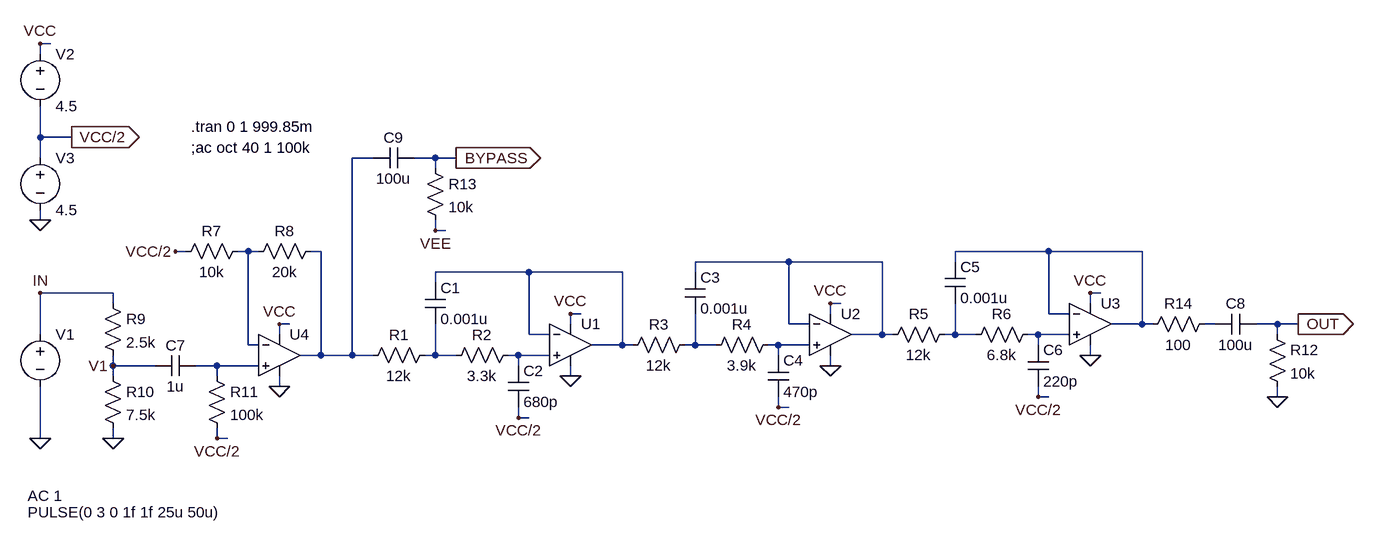
[diagram p0: schematic Nucleo_DCO_Output_VCVS_6th_Bessel_SQR_2.asc]
Nucleo_DCO_Output_VCVS_6th_Bessel_SQR_2.asc, the LTspice schematic file:
Version 4
SHEET 1 2020 680
WIRE -192 -448 -208 -448
WIRE -208 -432 -208 -448
WIRE -208 -304 -208 -352
WIRE -160 -304 -208 -304
WIRE -208 -272 -208 -304
WIRE 304 -272 272 -272
WIRE 400 -272 368 -272
WIRE 432 -272 400 -272
WIRE 400 -256 400 -272
WIRE -208 -176 -208 -192
WIRE 400 -160 400 -176
WIRE 416 -160 400 -160
WIRE 16 -128 0 -128
WIRE 112 -128 96 -128
WIRE 128 -128 112 -128
WIRE 224 -128 208 -128
WIRE 1344 -128 1200 -128
WIRE 1488 -128 1344 -128
WIRE 944 -112 800 -112
WIRE 1088 -112 944 -112
WIRE 1200 -112 1200 -128
WIRE 544 -96 400 -96
WIRE 688 -96 544 -96
WIRE 800 -96 800 -112
WIRE 400 -80 400 -96
WIRE -96 -64 -208 -64
WIRE 1424 -64 1408 -64
WIRE -96 -48 -96 -64
WIRE 1024 -48 1008 -48
WIRE 1408 -48 1408 -64
WIRE 624 -32 608 -32
WIRE 1008 -32 1008 -48
WIRE 1344 -32 1344 -128
WIRE 1376 -32 1344 -32
WIRE 176 -16 160 -16
WIRE 608 -16 608 -32
WIRE 944 -16 944 -112
WIRE 976 -16 944 -16
WIRE 1488 -16 1488 -128
WIRE 1488 -16 1440 -16
WIRE 1504 -16 1488 -16
WIRE 1600 -16 1584 -16
WIRE 1696 -16 1664 -16
WIRE 1728 -16 1696 -16
WIRE -208 0 -208 -64
WIRE 160 0 160 -16
WIRE 544 0 544 -96
WIRE 576 0 544 0
WIRE 1088 0 1088 -112
WIRE 1088 0 1040 0
WIRE 1104 0 1088 0
WIRE 1200 0 1200 -48
WIRE 1200 0 1184 0
WIRE 1232 0 1200 0
WIRE 1328 0 1312 0
WIRE 1376 0 1328 0
WIRE 1696 0 1696 -16
WIRE 112 16 112 -128
WIRE 128 16 112 16
WIRE 688 16 688 -96
WIRE 688 16 640 16
WIRE 704 16 688 16
WIRE 800 16 800 -32
WIRE 800 16 784 16
WIRE 832 16 800 16
WIRE 928 16 912 16
WIRE 976 16 928 16
WIRE 1328 16 1328 0
WIRE 224 32 224 -128
WIRE 224 32 192 32
WIRE 272 32 272 -272
WIRE 272 32 224 32
WIRE 304 32 272 32
WIRE 400 32 400 -16
WIRE 400 32 384 32
WIRE 432 32 400 32
WIRE 528 32 512 32
WIRE 576 32 528 32
WIRE 928 32 928 16
WIRE 1408 32 1408 16
WIRE -96 48 -96 32
WIRE -32 48 -96 48
WIRE 64 48 32 48
WIRE 128 48 64 48
WIRE 528 48 528 32
WIRE 1008 48 1008 32
WIRE -96 64 -96 48
WIRE 64 64 64 48
WIRE 608 64 608 48
WIRE 160 80 160 64
WIRE 1328 96 1328 80
WIRE 1344 96 1328 96
WIRE 1696 96 1696 80
WIRE 928 112 928 96
WIRE 944 112 928 112
WIRE 528 128 528 112
WIRE 544 128 528 128
WIRE -208 160 -208 80
WIRE -96 160 -96 144
WIRE 64 160 64 144
WIRE 80 160 64 160
FLAG 608 -32 VCC
FLAG -208 -448 VCC
FLAG -208 -64 IN
FLAG 1728 -16 OUT
IOPIN 1728 -16 Out
FLAG 1008 -48 VCC
FLAG 1408 -64 VCC
FLAG 160 -16 VCC
FLAG -208 -176 0
FLAG 432 -272 BYPASS
IOPIN 432 -272 Out
FLAG 400 -160 VEE
FLAG -160 -304 VCC/2
IOPIN -160 -304 Out
FLAG -208 160 0
FLAG -96 160 0
FLAG 0 -128 VCC/2
FLAG 64 160 VCC/2
FLAG 528 128 VCC/2
FLAG 928 112 VCC/2
FLAG 1328 96 VCC/2
FLAG 160 80 0
FLAG 608 64 0
FLAG 1008 48 0
FLAG 1408 32 0
FLAG 1696 96 0
FLAG -96 48 V1
SYMBOL voltage -208 -16 R0
WINDOW 3 -19 290 Left 2
WINDOW 123 -19 264 Left 2
WINDOW 39 0 0 Left 2
SYMATTR Value PULSE(0 3 0 1f 1f 25u 50u)
SYMATTR Value2 AC 1
SYMATTR InstName V1
SYMBOL res 400 16 R90
WINDOW 0 0 56 VBottom 2
WINDOW 3 32 56 VTop 2
SYMATTR InstName R1
SYMATTR Value 12k
SYMBOL res 528 16 R90
WINDOW 0 0 56 VBottom 2
WINDOW 3 32 56 VTop 2
SYMATTR InstName R2
SYMATTR Value 3.3k
SYMBOL cap 512 48 R0
SYMATTR InstName C2
SYMATTR Value 680p
SYMBOL cap 384 -80 R0
SYMATTR InstName C1
SYMATTR Value 0.001u
SYMBOL Opamps\\UniversalOpamp2 608 16 R0
SYMATTR InstName U1
SYMBOL voltage -208 -448 R0
WINDOW 123 0 0 Left 2
WINDOW 39 0 0 Left 2
SYMATTR InstName V2
SYMATTR Value 4.5
SYMBOL voltage -208 -288 R0
WINDOW 123 0 0 Left 2
WINDOW 39 0 0 Left 2
SYMATTR InstName V3
SYMATTR Value 4.5
SYMBOL res 800 0 R90
WINDOW 0 0 56 VBottom 2
WINDOW 3 32 56 VTop 2
SYMATTR InstName R3
SYMATTR Value 12k
SYMBOL res 928 0 R90
WINDOW 0 0 56 VBottom 2
WINDOW 3 32 56 VTop 2
SYMATTR InstName R4
SYMATTR Value 3.9k
SYMBOL cap 912 32 R0
SYMATTR InstName C4
SYMATTR Value 470p
SYMBOL cap 784 -96 R0
SYMATTR InstName C3
SYMATTR Value 0.001u
SYMBOL Opamps\\UniversalOpamp2 1008 0 R0
SYMATTR InstName U2
SYMBOL res 1200 -16 R90
WINDOW 0 0 56 VBottom 2
WINDOW 3 32 56 VTop 2
SYMATTR InstName R5
SYMATTR Value 12k
SYMBOL res 1328 -16 R90
WINDOW 0 0 56 VBottom 2
WINDOW 3 32 56 VTop 2
SYMATTR InstName R6
SYMATTR Value 6.8k
SYMBOL cap 1312 16 R0
SYMATTR InstName C6
SYMATTR Value 220p
SYMBOL cap 1184 -112 R0
SYMATTR InstName C5
SYMATTR Value 0.001u
SYMBOL Opamps\\UniversalOpamp2 1408 -16 R0
SYMATTR InstName U3
SYMBOL Opamps\\UniversalOpamp2 160 32 R0
SYMATTR InstName U4
SYMBOL res 112 -144 R90
WINDOW 0 0 56 VBottom 2
WINDOW 3 32 56 VTop 2
SYMATTR InstName R7
SYMATTR Value 10k
SYMBOL res 224 -144 R90
WINDOW 0 0 56 VBottom 2
WINDOW 3 32 56 VTop 2
SYMATTR InstName R8
SYMATTR Value 20k
SYMBOL res -112 -64 R0
SYMATTR InstName R9
SYMATTR Value 2.5k
SYMBOL res -112 48 R0
SYMATTR InstName R10
SYMATTR Value 7.5k
SYMBOL cap -32 32 M90
WINDOW 0 0 32 VBottom 2
WINDOW 3 32 32 VTop 2
SYMATTR InstName C7
SYMATTR Value 1u
SYMBOL res 48 48 R0
SYMATTR InstName R11
SYMATTR Value 100k
SYMBOL cap 1664 -32 R90
WINDOW 0 0 32 VBottom 2
WINDOW 3 32 32 VTop 2
SYMATTR InstName C8
SYMATTR Value 100u
SYMBOL res 1680 -16 R0
SYMATTR InstName R12
SYMATTR Value 10k
SYMBOL res 384 -272 R0
SYMATTR InstName R13
SYMATTR Value 10k
SYMBOL cap 368 -288 R90
WINDOW 0 0 32 VBottom 2
WINDOW 3 32 32 VTop 2
SYMATTR InstName C9
SYMATTR Value 100u
SYMBOL res 1600 -32 R90
WINDOW 0 0 56 VBottom 2
WINDOW 3 32 56 VTop 2
SYMATTR InstName R14
SYMATTR Value 100
TEXT 24 -320 Left 2 !.tran 0 1 999.85m
TEXT 24 -288 Left 2 !;ac oct 40 1 100k

The netlist it stands for:
* Nucleo_DCO_Output_VCVS_6th_Bessel_SQR_2.asc
V1 IN 0 PULSE(0 3 0 1f 1f 25u 50u) AC 1
R1 N011 N001 12k
R2 N012 N011 3.3k
C2 N012 VCC/2 680p
C1 N005 N011 0.001u
XU1 N012 N005 VCC 0 N005 level.2 Avol=1Meg GBW=10Meg Slew=10Meg ilimit=25m rail=0 Vos=0 phimargin=45 en=0 enk=0 in=0 ink=0 Rin=500Meg  ; pins IN+ IN- V+ V- OUT
V2 VCC VCC/2 4.5
V3 VCC/2 0 4.5
R3 N009 N005 12k
R4 N010 N009 3.9k
C4 N010 VCC/2 470p
C3 N004 N009 0.001u
XU2 N010 N004 VCC 0 N004 level.2 Avol=1Meg GBW=10Meg Slew=10Meg ilimit=25m rail=0 Vos=0 phimargin=45 en=0 enk=0 in=0 ink=0 Rin=500Meg  ; pins IN+ IN- V+ V- OUT
R5 N007 N004 12k
R6 N008 N007 6.8k
C6 N008 VCC/2 220p
C5 N003 N007 0.001u
XU3 N008 N003 VCC 0 N003 level.2 Avol=1Meg GBW=10Meg Slew=10Meg ilimit=25m rail=0 Vos=0 phimargin=45 en=0 enk=0 in=0 ink=0 Rin=500Meg  ; pins IN+ IN- V+ V- OUT
XU4 N013 N002 VCC 0 N001 level.2 Avol=1Meg GBW=10Meg Slew=10Meg ilimit=25m rail=0 Vos=0 phimargin=45 en=0 enk=0 in=0 ink=0 Rin=500Meg  ; pins IN+ IN- V+ V- OUT
R7 N002 VCC/2 10k
R8 N001 N002 20k
R9 IN V1 2.5k
R10 V1 0 7.5k
C7 V1 N013 1u
R11 N013 VCC/2 100k
C8 OUT N006 100u
R12 OUT 0 10k
R13 BYPASS VEE 10k
C9 BYPASS N001 100u
R14 N006 N003 100
.tran 0 1 999.85m
;ac oct 40 1 100k
.lib UniversalOpamps2.sub
.backanno
.end